# EAGLE design legs new (EAGLE 9.3.0)
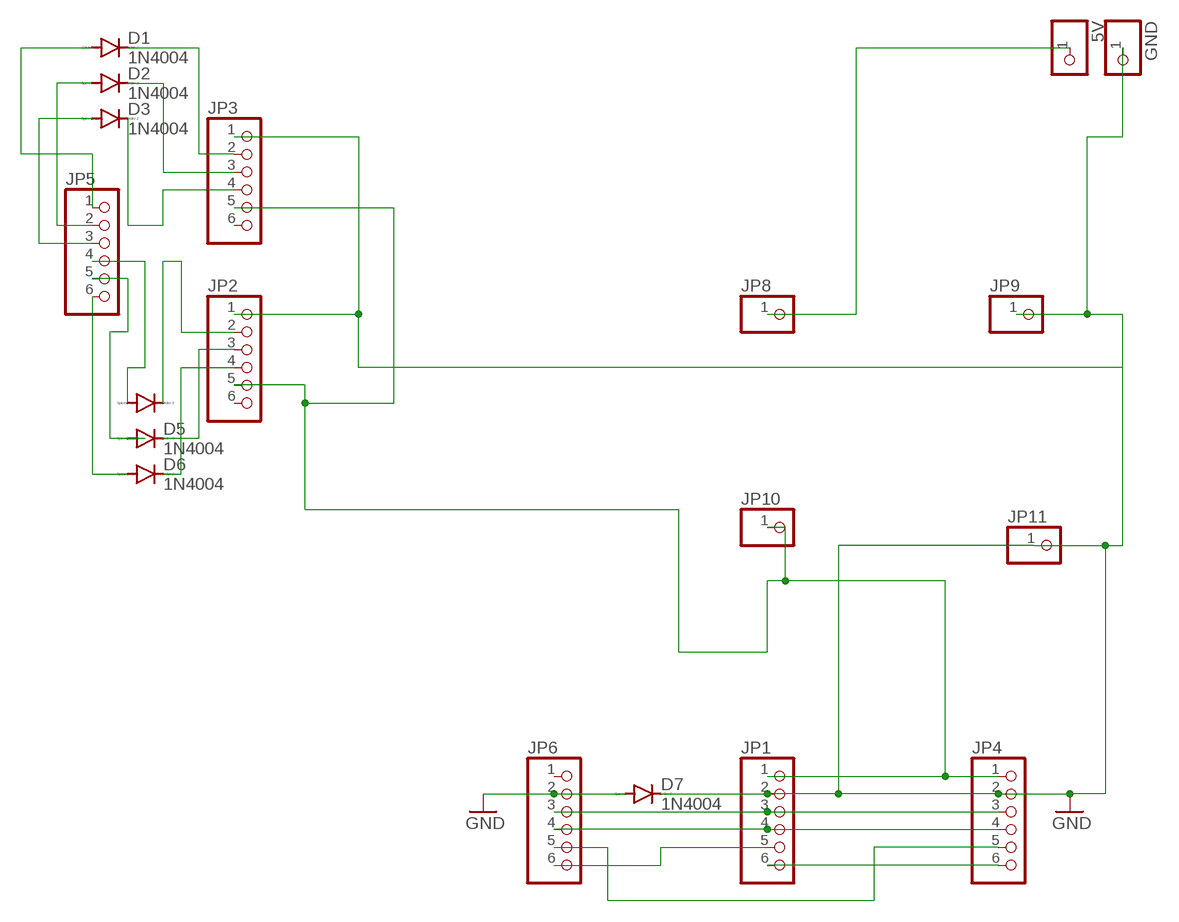
[diagram p0: schematic, sheet 1]

## Parts
5V  PINHD-1X1  [1X01]
D1  1N4004  [DO41-10]
D2  1N4004  [DO41-10]
D3  1N4004  [DO41-10]
D4  1N4004  [DO41-10]
D5  1N4004  [DO41-10]
D6  1N4004  [DO41-10]
D7  1N4004  [DO41-10]
GND  PINHD-1X1  [1X01]
JP1  PINHD-1X6  [1X06]
JP2  PINHD-1X6  [1X06]
JP3  PINHD-1X6  [1X06]
JP4  PINHD-1X6  [1X06]
JP5  PINHD-1X6  [1X06]
JP6  PINHD-1X6  [1X06]
JP8  PINHD-1X1  [1X01]
JP9  PINHD-1X1  [1X01]
JP10  PINHD-1X1  [1X01]
JP11  PINHD-1X1  [1X01]

## Nets
GND: D7.A D7.C GND.1 JP1.2 JP2.1 JP3.1 JP4.2 JP6.2 JP9.1 JP11.1
N$1: 5V.1 JP8.1
N$2: D1.A JP5.1
N$3: D2.A JP5.2
N$4: JP1.4 JP4.4 JP6.4
N$5: D3.C JP3.4
N$6: JP1.6 JP4.6
N$7: D4.C JP2.2
N$8: D5.A JP5.5
N$9: D6.A JP5.6
N$10: JP4.5 JP6.5
N$11: JP1.3 JP4.3 JP6.3
N$12: JP1.5 JP6.6
N$13: D4.A JP5.4
N$14: D6.C JP2.4
N$15: D5.C JP2.3
N$17: D1.C JP3.2
N$18: D3.A JP5.3
N$19: D2.C JP3.3
VCC: JP1.1 JP2.5 JP3.5 JP4.1 JP10.1
Unconnected: JP2.6 JP3.6 JP6.1

## Library data of the parts
5V GND JP8-JP11 = pinhead:PINHD-1X1: PIN HEADER
D1-D7 = diode:1N4004: DIODE general purpose rectifier, 1 A
JP1-JP6 = pinhead:PINHD-1X6: PIN HEADER

## Board
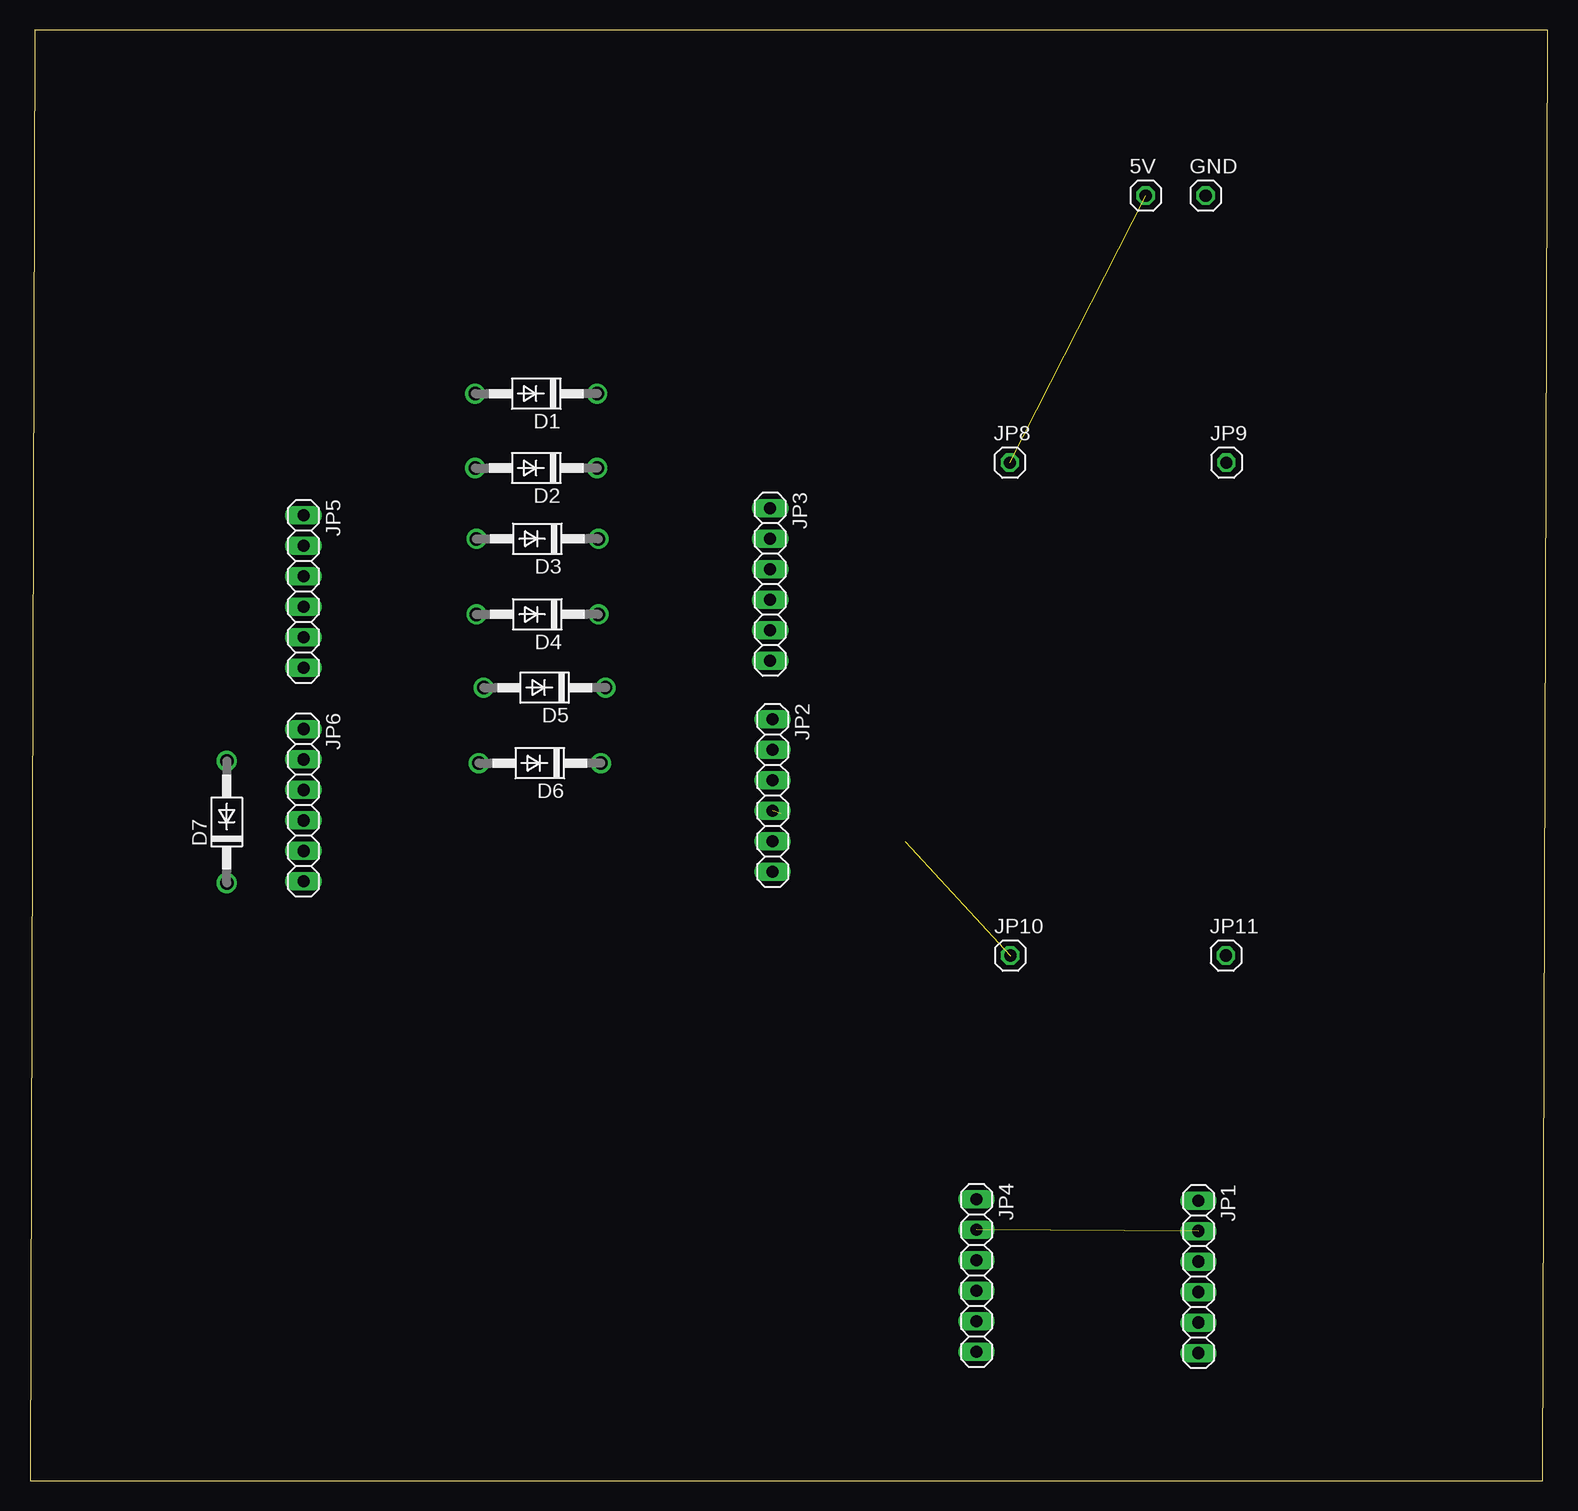
[diagram p1: board, top side]
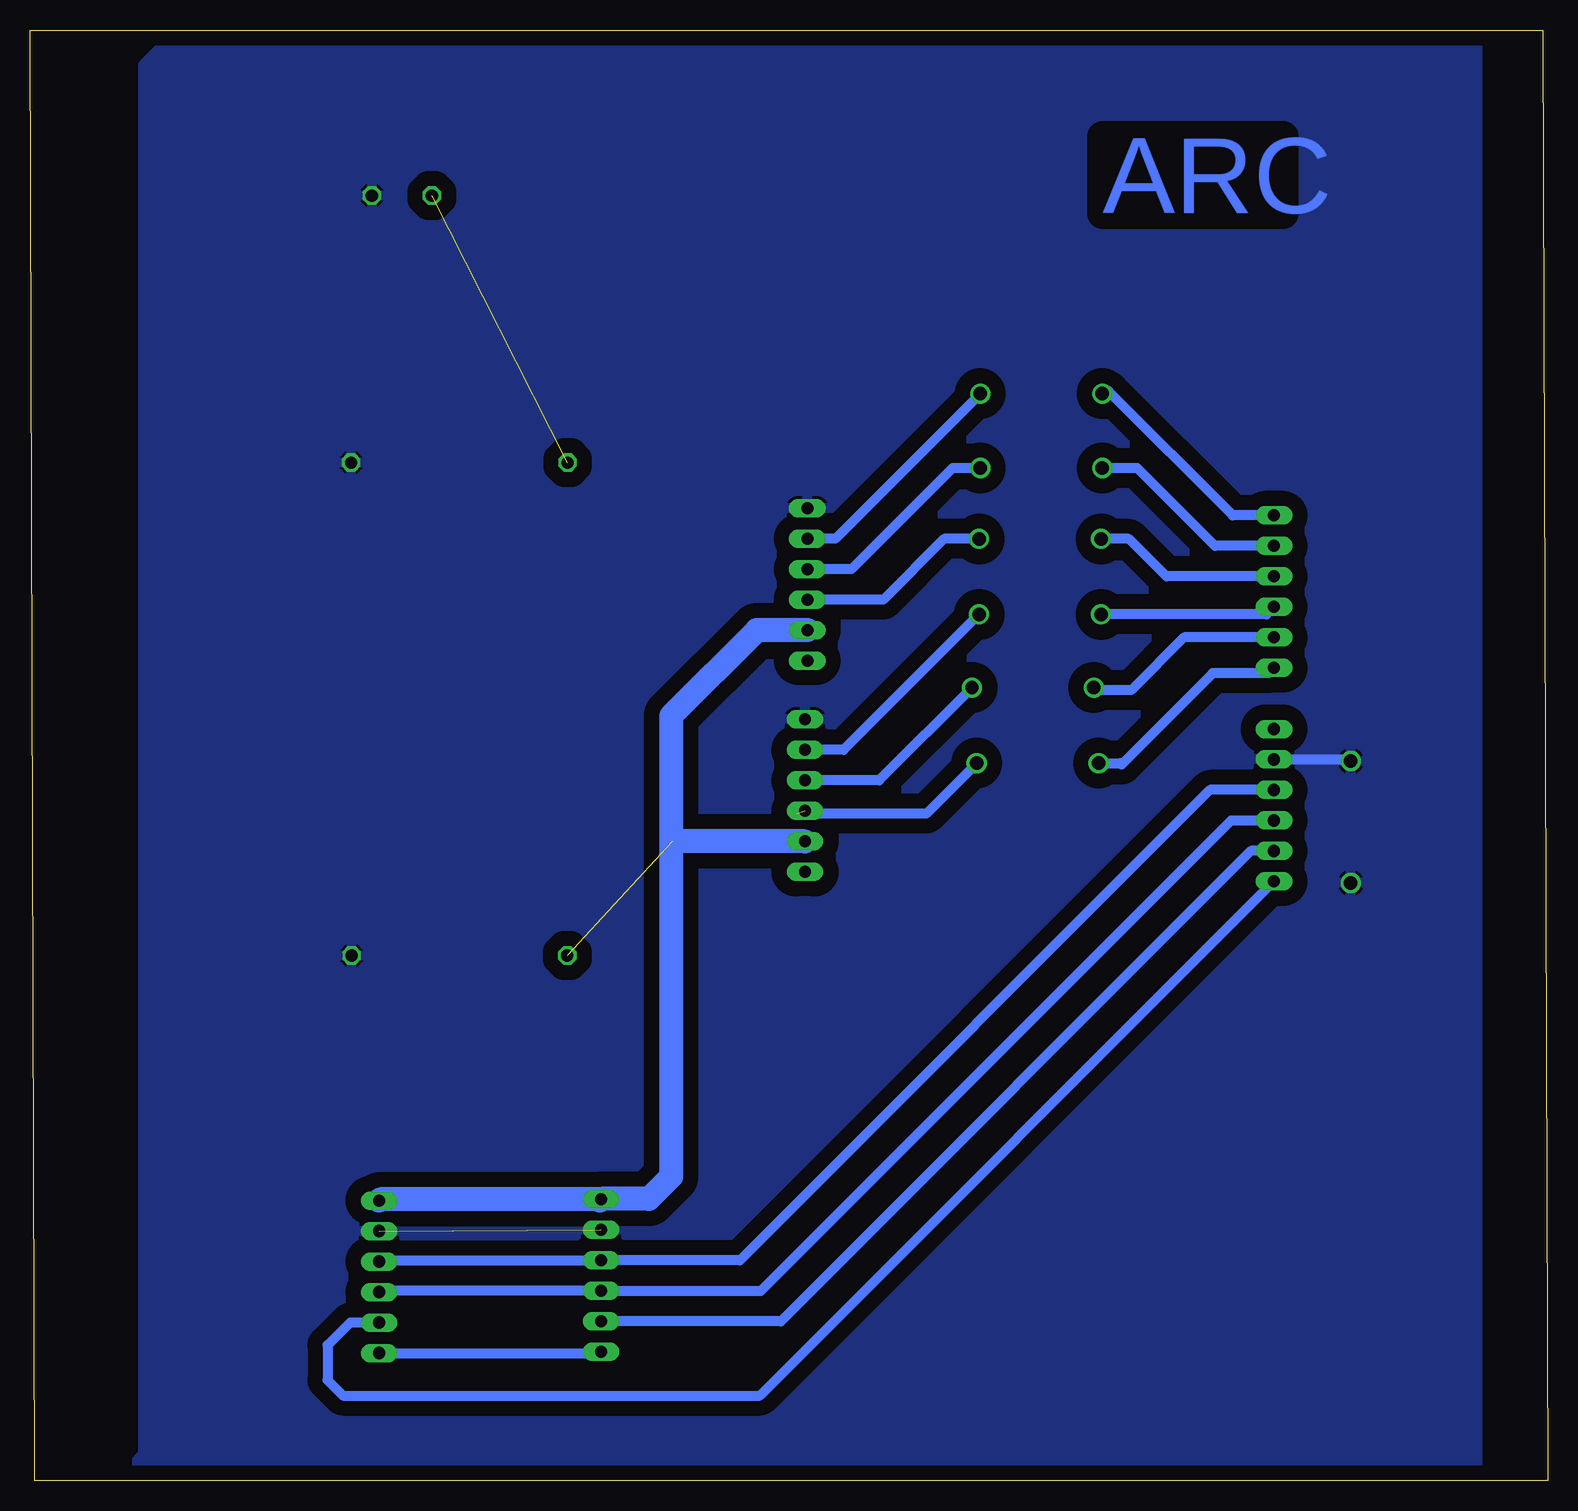
[diagram p2: board, bottom side, seen from below]

Size 126.5 x 120.9 mm. Coordinates in mm from the lower left corner, seen from the top.
Outline: 0,0 126.1,0 126.5,120.9 0.4,120.9 0,0
Copper layers (1*16): Top 0.035mm / dielectric 1.5mm / Bottom 0.035mm
Design rules "default": minimum track width 6mil, minimum drill 0.35mm, track to track 6mil, track to pad 6mil, pad to pad 6mil, via to via 6mil, smd to smd 6mil, copper to edge 40mil, drill to drill 6mil, minimum pad ring 10mil, minimum via ring 8mil, stop-mask expansion 4mil, vias tented up to drill 0mil, thermal gap 10mil

### Footprints (pad centres in the part's own frame; a part is rotated, then mirrored left to right if it is on the bottom)
1X01 = drill 1.016 octagon: 1 0,0
DO41-10 = drill 1.118: A 5.08,0; C -5.08,0
1X06 = drill 1.016 long: 1 -6.35,0; 2 -3.81,0; 3 -1.27,0; 4 1.27,0; 5 3.81,0; 6 6.35,0

### Placement (x,y rotation side)
5V  93,107.1 0 top
D1  42.2,90.6 180 top
D2  42.2,84.4 180 top
D3  42.3,78.5 180 top
D4  42.3,72.2 180 top
D5  42.9,66.1 180 top
D6  42.5,59.8 180 top
D7  16.4,54.9 90 top
GND  98,107.1 0 top
JP1  97.4,17 270 top
JP2  61.9,57.1 270 top
JP3  61.7,74.7 270 top
JP4  78.9,17.1 270 top
JP5  22.8,74.1 270 top
JP6  22.8,56.3 270 top
JP8  81.68,84.85 0 top
JP9  99.73,84.85 0 top
JP10  81.72,43.77 0 top
JP11  99.69,43.77 0 top

### Tracks (layer width: path | path; a pad name or v marks a point on that pad's centre or on a via)
GND  (1 unrouted)
  Bottom 0.813: JP6.2 16.53,60.11 D7.A
  pour Bottom (isolate 1.27): 5.8,119.8 115.3,119.8 117.1,118 117.1,2.2 117.9,1.4 5.8,1.4
N$1  (1 unrouted)
N$2
  Bottom 0.813: 23.04,80.21 JP5.1 26.25,80.45 36.6,90.8 36.92,90.8 D1.A
N$3
  Bottom 0.813: JP5.2 27.71,77.91 34.2,84.4 D2.A
N$4
  Bottom 0.813: JP1.4 97.3,15.83 JP4.4 65.57,15.83 26.37,55.03 JP6.4
N$5
  Bottom 0.813: D3.C 50.3,78.5 55.37,73.43 JP3.4
N$6
  Bottom 0.813: JP1.6 79,10.65 JP4.6
N$7
  Bottom 0.813: D4.C 58.67,60.91 JP2.2
N$8
  Bottom 0.813: D5.A 37.62,65.9 34.7,65.9 30.31,70.29 JP5.5
N$9
  Bottom 0.813: JP5.6 23.25,67.3 27.9,67.3 35.5,59.7 35.6,59.8 D6.A
N$10
  Bottom 0.813: JP6.5 24.71,52.49 63.91,13.29 JP4.5
N$11
  Bottom 0.813: JP1.3 97.3,18.37 JP4.3 67.33,18.37 28.13,57.57 JP6.3
N$12
  Bottom 0.813: JP6.6 65.65,7.1 100.4,7.1 101.7,8.4 101.7,11.3 99.81,13.19 JP1.5
N$13
  Bottom 0.813: JP5.4 23.43,72.2 D4.A
N$14  (1 unrouted)
  Bottom 0.813: D6.C 51.78,55.6 62.6,55.6
N$15
  Bottom 0.813: D5.C 55.71,58.37 JP2.3
N$17
  Bottom 0.813: D1.C 59.37,78.51 JP3.2
N$18
  Bottom 0.813: JP5.3 31.77,75.37 34.9,78.5 D3.A
N$19
  Bottom 0.813: D2.C 49.6,84.4 58.03,75.97 JP3.3
VCC  (1 unrouted)
  Bottom 0.813: 79,23.35 JP4.1
  Bottom 2: 79,23.35 78.85,23.5 74.9,23.5 73.05,25.35 73.05,53.4 | JP4.1 97.3,23.45 JP1.1 | JP3.5 65.91,70.89 73.05,63.75 73.05,53.4 | JP2.5 72.94,53.29 73.05,53.4

### Text on the board
Bottom: ARC